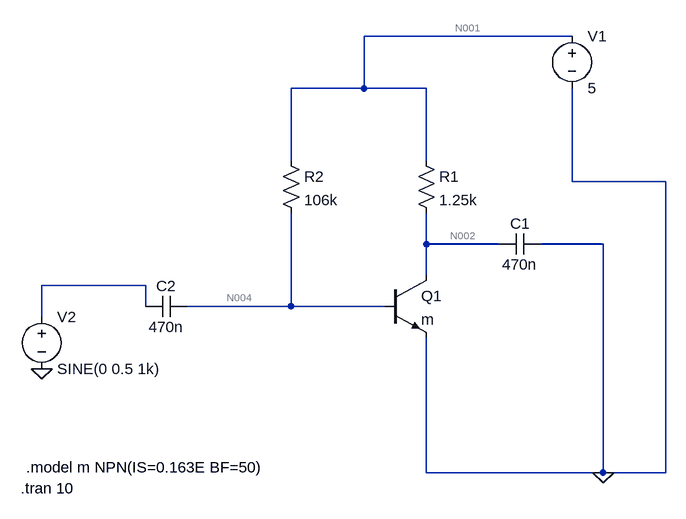
[diagram p0: schematic BJT.asc]
BJT.asc, the LTspice schematic file:
Version 4.1
SHEET 1 880 680
WIRE 528 -176 208 -176
WIRE 208 -96 208 -176
WIRE 208 -96 96 -96
WIRE 304 -96 208 -96
WIRE 96 16 96 -96
WIRE 304 16 304 -96
WIRE 528 48 528 -96
WIRE 672 48 528 48
WIRE 304 144 304 96
WIRE 416 144 304 144
WIRE 576 144 480 144
WIRE 304 192 304 144
WIRE -128 208 -288 208
WIRE -128 240 -128 208
WIRE 96 240 96 96
WIRE 96 240 -64 240
WIRE 240 240 96 240
WIRE -288 256 -288 208
WIRE 304 496 304 288
WIRE 576 496 576 144
WIRE 576 496 304 496
WIRE 672 496 672 48
WIRE 672 496 576 496
FLAG -288 336 0
FLAG 576 496 0
SYMBOL npn 240 192 R0
SYMATTR InstName Q1
SYMATTR Value m
SYMBOL res 288 0 R0
SYMATTR InstName R1
SYMATTR Value 1.25k
SYMBOL res 80 0 R0
SYMATTR InstName R2
SYMATTR Value 106k
SYMBOL voltage 528 -192 R0
WINDOW 123 0 0 Left 0
WINDOW 39 0 0 Left 0
SYMATTR InstName V1
SYMATTR Value 5
SYMBOL cap 480 128 R90
WINDOW 0 0 32 VBottom 2
WINDOW 3 32 32 VTop 2
SYMATTR InstName C1
SYMATTR Value 470n
SYMBOL cap -64 224 R90
WINDOW 0 0 32 VBottom 2
WINDOW 3 32 32 VTop 2
SYMATTR InstName C2
SYMATTR Value 470n
SYMBOL voltage -288 240 R0
WINDOW 123 0 0 Left 0
WINDOW 39 0 0 Left 0
SYMATTR InstName V2
SYMATTR Value SINE(0 0.5 1k)
TEXT -320 520 Left 2 !.tran 10
TEXT -312 488 Left 2 !.model m NPN(IS=0.163E BF=50)

The netlist it stands for:
* BJT.asc
Q1 N002 N004 0 0 m
R1 N001 N002 1.25k
R2 N001 N004 106k
V1 N001 0 5
C1 0 N002 470n
C2 N004 N003 470n
V2 N003 0 SINE(0 0.5 1k)
.model NPN NPN
.model PNP PNP
.lib standard.bjt
.tran 10
.model m NPN(IS=0.163E BF=50)
.backanno
.end

* Results of the author's LTspice run, read from the files saved beside the schematic
* Operating Point, zero values left out:
*   V(n004) = 617.2 µV
*   V(n002) = 622.2 µV
*   V(n001) = 5 V
*   Ic(Q1) = 4 mA
*   Ib(Q1) = 47.16 µA
*   Ie(Q1) = -4.047 mA
*   I(R2) = 47.16 µA
*   I(V1) = -4.047 mA
*   I(R1) = 4 mA